# Altium schematic sheet 2014_YaourtPhone.SchDoc
size A4
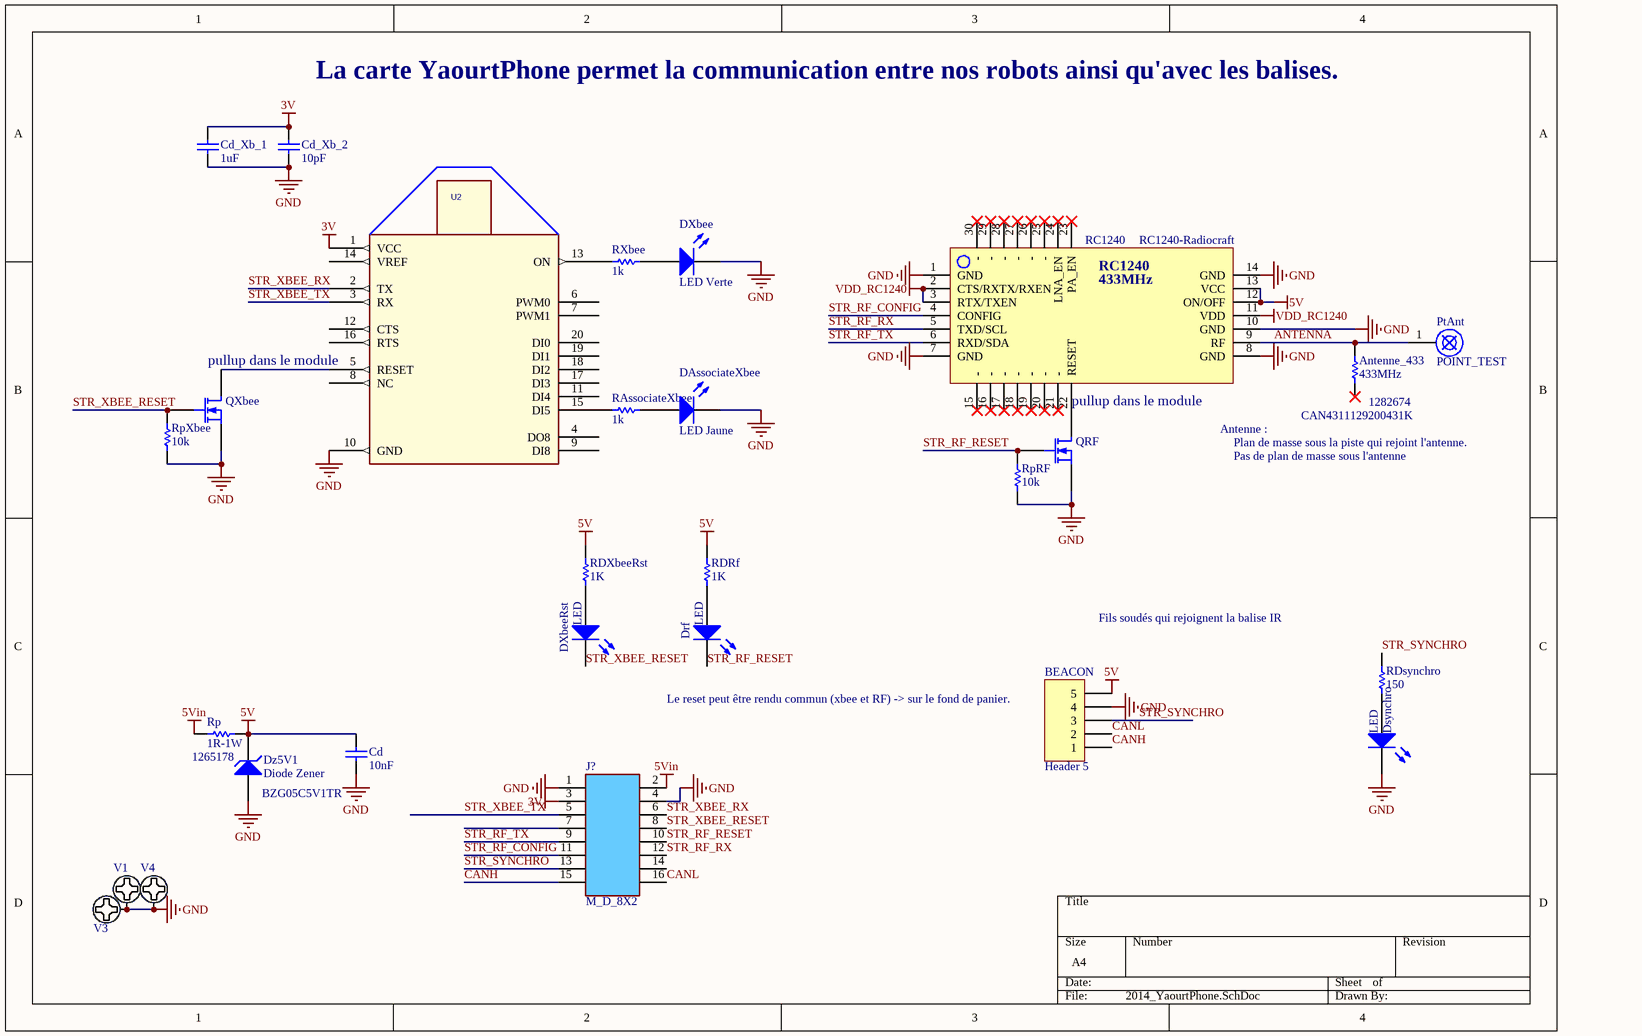
[diagram p0: 2014_YaourtPhone.SchDoc]

## Parts
Antenne_433  433MHz  FAR: 1282674  [R1206_N]
BEACON  Header 5  [HDR1X5]
Cd  10nF  [C1206_N]
Cd_Xb_1  1uF  [C0805_N]
Cd_Xb_2  10pF  [C0805_N]
DAssociateXbee  LED Jaune  [LED_0805]
Drf  LED  [LED_0805]
Dsynchro  LED  [LED_0805]
DXbee  LED Verte  [LED_0805]
DXbeeRst  LED  [LED_0805]
Dz5V1  Diode Zener  [SMA Diode]
J?  Type: M_D_8X2  [HE10/16_M_D_B P]  (hidden comment: BARRETTE_8 CONTACTS_2 RANGEES_MALE_DROITE)
PtAnt  POINT_TEST  [POINT_TEST]
QRF  Transistor MOSFET-N  [SOT23-3N]  (value not drawn)
QXbee  Transistor MOSFET-N  [SOT23-3N]  (value not drawn)
RAssociateXbee  1k  [R1206_N]
RC1240  RC1240-Radiocraft  [RC1240]
RDRf  1K  [R1206_N]
RDsynchro  150  [R1206_N]
RDXbeeRst  1K  [R1206_N]
Rp  1R-1W  FAR: 1265178  [INDUCTANCE_CMS_1812]
RpRF  10k  [R1206_N]
RpXbee  10k  [R1206_N]
RXbee  1k  [R1206_N]
U2  XBee  [MODULE_XBEE]  (value not drawn)
V1  Pad_M3  [M3x6mm]  (value not drawn)
V3  Pad_M3  [M3x6mm]  (value not drawn)
V4  Pad_M3  [M3x6mm]  (value not drawn)

## Nets
3V: Cd_Xb_1.2 Cd_Xb_2.2 J?.3 U2.1(VCC)
5V: BEACON.5 Cd.2 Dz5V1.2(K) RC1240.12(ON/OFF) RC1240.13(VCC) RDRf.1 RDXbeeRst.1 Rp.2
5Vin: J?.2 Rp.1
GND: BEACON.4 Cd.1 Cd_Xb_1.1 Cd_Xb_2.1 DAssociateXbee.2(K) Dsynchro.2(K) DXbee.2(K) Dz5V1.1(A) J?.1 J?.4 QRF.2(S) QXbee.2(S) RC1240.1(GND) RC1240.7(GND) RC1240.8(GND) RC1240.10(GND) RC1240.14(GND) RpRF.2 RpXbee.2 U2.10(GND) V1.1 V3.1 V4.1
VDD_RC1240: RC1240.2(CTS/RXTX/RXEN) RC1240.3(RTX/TXEN) RC1240.11(VDD)
ANTENNA: Antenne_433.1 PtAnt.1 RC1240.9(RF)
CANH: BEACON.1 J?.15
CANL: BEACON.2 J?.16
STR_RF_CONFIG: J?.11 RC1240.4(CONFIG)
STR_RF_RESET: Drf.2(K) J?.10 QRF.1(G) RpRF.1
STR_RF_RX: J?.12 RC1240.5(TXD/SCL)
STR_RF_TX: J?.9 RC1240.6(RXD/SDA)
STR_SYNCHRO: BEACON.3 J?.13 RDsynchro.1
STR_XBEE_RESET: DXbeeRst.2(K) J?.8 QXbee.1(G) RpXbee.1
STR_XBEE_RX: J?.6 U2.2(TX)
STR_XBEE_TX: J?.5 U2.3(RX)
NetDAssociateXbee_1: DAssociateXbee.1(A) RAssociateXbee.2
NetDrf_1: Drf.1(A) RDRf.2
NetDsynchro_1: Dsynchro.1(A) RDsynchro.2
NetDXbee_1: DXbee.1(A) RXbee.2
NetDXbeeRst_1: DXbeeRst.1(A) RDXbeeRst.2
NetQRF_3: QRF.3(D) RC1240.22(RESET)
NetQXbee_3: QXbee.3(D) U2.5(RESET)
NetRAssociateXbee_1: RAssociateXbee.1 U2.15(DI5)
NetRXbee_1: RXbee.1 U2.13(ON)

Not connected (* = marked no-connect by the designer): Antenne_433 2*; J? 7 14; RC1240 15(-)* 16(-)* 17(-)* 18(-)* 19(-)* 20(-)* 21(-)* 23(PA_EN)* 24(LNA_EN)* 25(-)* 26(-)* 27(-)* 28(-)* 29(-)* 30(-)*; U2 4(DO8) 6(PWM0) 7(PWM1) 8(NC) 9(DI8) 11(DI4) 12(CTS) 14(VREF) 16(RTS) 17(DI3) 18(DI2) 19(DI1) 20(DI0)

## Notes on the sheet
- La carte YaourtPhone permet la communication entre nos robots ainsi qu'avec les balises.
- (near U2) pullup dans le module
- (near RC1240) pullup dans le module
- (near RC1240) Antenne :
- Plan de masse sous la piste qui rejoint l'antenne.
- Pas de plan de masse sous l'antenne
- Fils soudés qui rejoignent la balise IR
- (near BEACON) Le reset peut être rendu commun (xbee et RF) -> sur le fond de panier.
- (in symbol Diode Zener) BZG05C5V1TR
- (in symbol RC1240-Radiocraft) 433MHz

## Library data of the parts
Antenne_433 = Resistor: CAN4311129200431K; Published: 8-Jun-2000; LatestRevisionDate: 17-Jul-2002; LatestRevisionNote: Re-released for DXP Platform.; PackageReference: CAN4311129200431K; Publisher: Altium Limited
BEACON = Header 5: Header, 5-Pin; LatestRevisionDate: 17-Jul-2002; LatestRevisionNote: Re-released for DXP Platform.; Publisher: Altium Limited
Cd Cd_Xb_1 Cd_Xb_2 = Condensateur: Capacitor; Published: 8-Jun-2000; LatestRevisionDate: 17-Jul-2002; LatestRevisionNote: Re-released for DXP Platform.; PackageReference: RAD-0.3; Publisher: Altium Limited
DAssociateXbee Drf Dsynchro DXbee DXbeeRst = LED: Typical LED; Published: 8-Jun-2000; LatestRevisionDate: 08-Jul-2005; LatestRevisionNote: Mech Layer 1 removed.; PackageReference: LED-1; Publisher: Altium Limited
Dz5V1 = Diode Zener: Zener Diode
PtAnt = POINT_TEST: POINT TEST
QRF QXbee = Transistor MOSFET-N: N-Channel MOSFET; PackageDocument: 1995/1996; Published: 8-Jun-2000; LatestRevisionDate: 17-Jul-2002; LatestRevisionNote: Re-released for DXP Platform.; PackageReference: E3; Publisher: Altium Limited
RAssociateXbee RDRf RDsynchro RDXbeeRst Rp RpRF RpXbee RXbee = Resistor: Published: 8-Jun-2000; LatestRevisionDate: 17-Jul-2002; LatestRevisionNote: Re-released for DXP Platform.; PackageReference: AXIAL-0.5; Publisher: Altium Limited
RC1240 = RC1240-Radiocraft: RC1240 - Radiocraft 433MHz Transceiver
V1 V3 V4 = Vis M3 X 6mm _TORX_Tête 6mm: Publisher: Damien Guitton